# Altium schematic sheet IsolatedPortOut.SchDoc
size A4
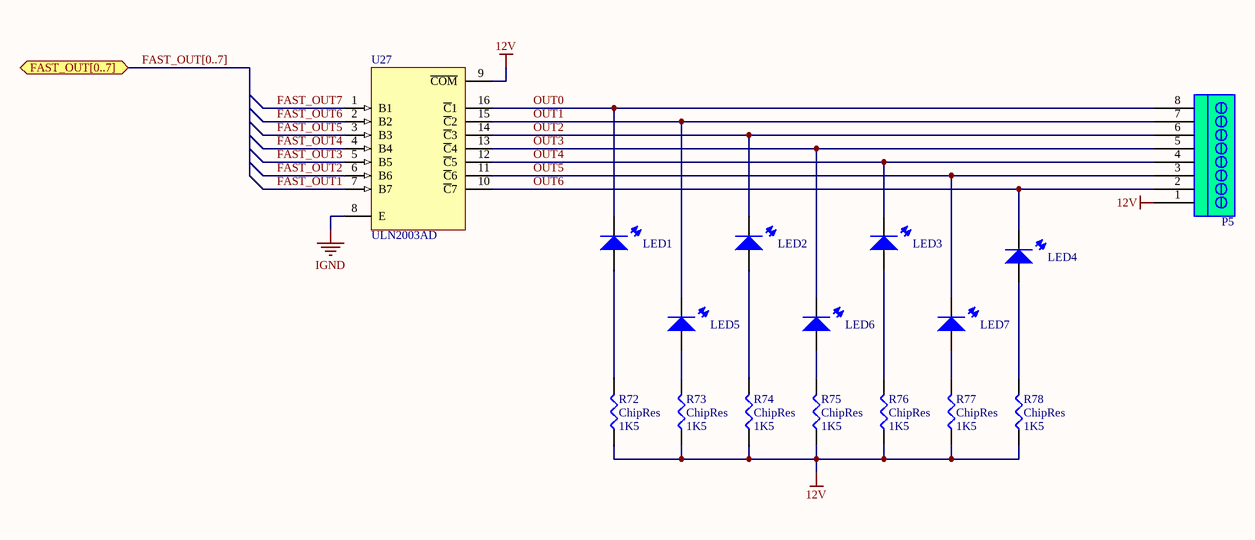
[diagram p0: IsolatedPortOut.SchDoc]

## Parts
LED1  LED 0603  [LED 0603]  (value not drawn)
LED2  LED 0603  [LED 0603]  (value not drawn)
LED3  LED 0603  [LED 0603]  (value not drawn)
LED4  LED 0603  [LED 0603]  (value not drawn)
LED5  LED 0603  [LED 0603]  (value not drawn)
LED6  LED 0603  [LED 0603]  (value not drawn)
LED7  LED 0603  [LED 0603]  (value not drawn)
P5  Terminal Block 8x5.08mm  [SOCKET 8x5.08]  (value not drawn)
R72  ChipRes  value 1K5  [RES0805]
R73  ChipRes  value 1K5  [RES0805]
R74  ChipRes  value 1K5  [RES0805]
R75  ChipRes  value 1K5  [RES0805]
R76  ChipRes  value 1K5  [RES0805]
R77  ChipRes  value 1K5  [RES0805]
R78  ChipRes  value 1K5  [RES0805]
U27  ULN2003AD  [D016_N]

## Ports
FAST_OUT[0..7]

## Nets
12V: P5.1 R72.1 R73.1 R74.1 R75.1 R76.1 R77.1 R78.1 U27.9(~{COM})
IGND: U27.8(E)
FAST_OUT1: U27.7(B7)
FAST_OUT2: U27.6(B6)
FAST_OUT3: U27.5(B5)
FAST_OUT4: U27.4(B4)
FAST_OUT5: U27.3(B3)
FAST_OUT6: U27.2(B2)
FAST_OUT7: U27.1(B1)
OUT0: LED1.1 P5.8 U27.16(~{C}1)
OUT1: LED5.1 P5.7 U27.15(~{C}2)
OUT2: LED2.1 P5.6 U27.14(~{C}3)
OUT3: LED6.1 P5.5 U27.13(~{C}4)
OUT4: LED3.1 P5.4 U27.12(~{C}5)
OUT5: LED7.1 P5.3 U27.11(~{C}6)
OUT6: LED4.1 P5.2 U27.10(~{C}7)
NetLED1_2: LED1.2 R72.2
NetLED2_2: LED2.2 R74.2
NetLED3_2: LED3.2 R76.2
NetLED4_2: LED4.2 R78.2
NetLED5_2: LED5.2 R73.2
NetLED6_2: LED6.2 R75.2
NetLED7_2: LED7.2 R77.2

## Buses and harness runs
bus FAST_OUT[0..7] = port FAST_OUT[0..7]

## Library data of the parts
LED1-LED7 = LED0603
P5 = Socket_8x5.08_RA_2Wall: Terminal Block Socket Right Angle 8x5.08mm 2-Wall
R72-R78 = ChipRes: Chip resistor
U27 = ULN2003AD: Darlington Transistor Array; Published: 15-May-2002; LatestRevisionDate: 13-Apr-2006; LatestRevisionNote: IPC-7351 Footprint Added.; DatasheetVersion: Sep-1986; PackageVersion: Jan-1998; PackageReference: D016; Publisher: Altium Limited; PackageDescription: 16-Pin Small Outline Integrated Circuit 1.27 mm Pitch; Code_IPC: SOIC127P600-16; ComponentLink1Description: Manufacturer Link; ComponentLink1URL: http://www.ti.com/; ComponentLink2Description: Datasheet; ComponentLink2URL: http://www-s.ti.com/sc/ds/uln2002a.pdf